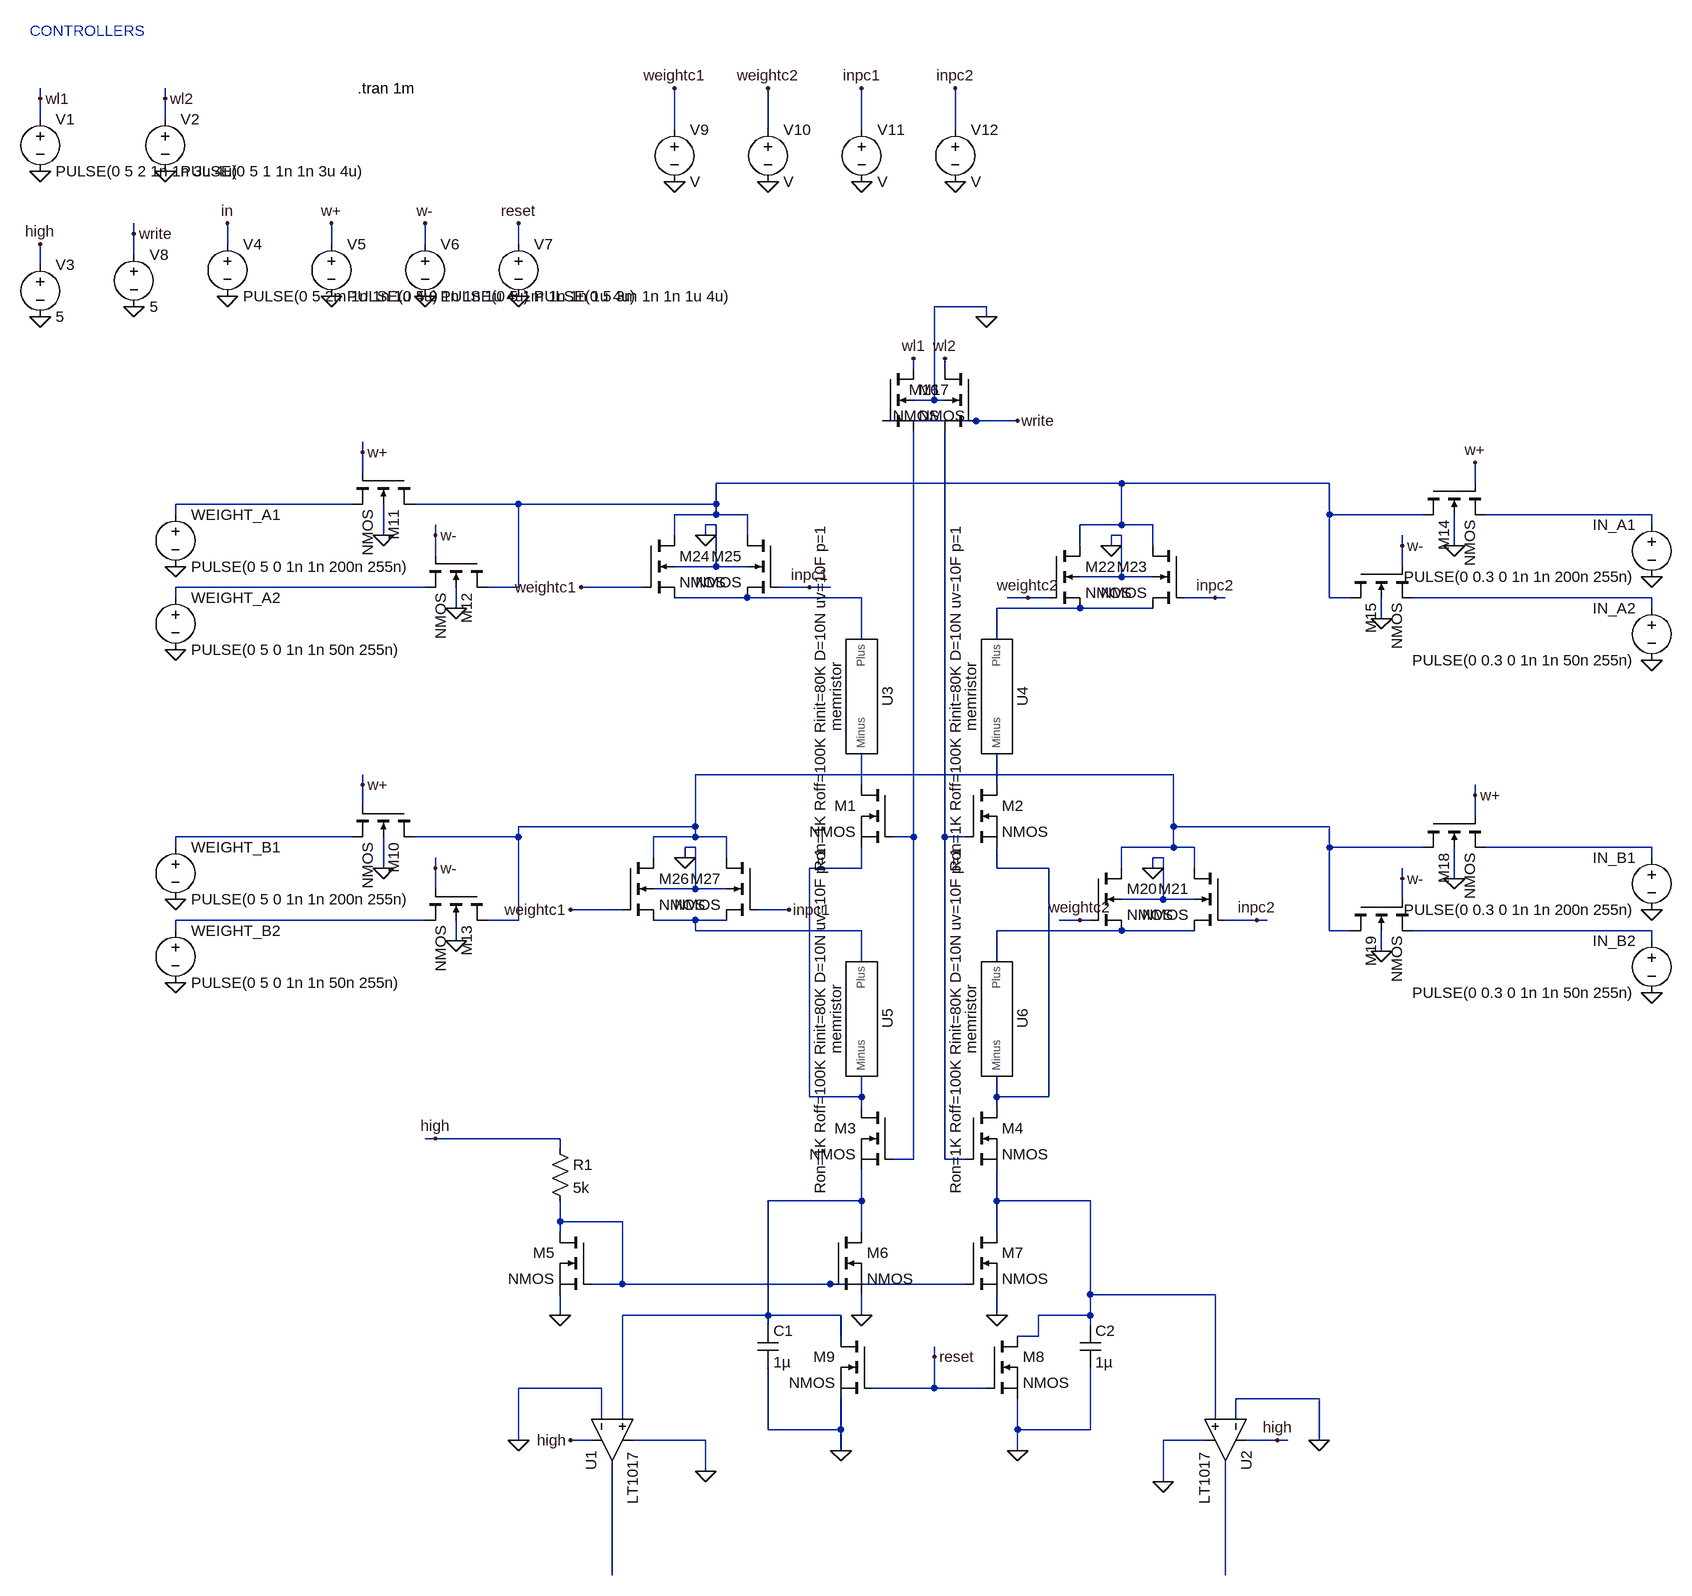
[diagram p0: schematic mac_v1.asc]
mac_v1.asc, the LTspice schematic file:
Version 4
SHEET 1 2132 1428
WIRE -864 -848 -864 -864
WIRE -672 -848 -672 -864
WIRE -864 -816 -864 -848
WIRE -672 -816 -672 -848
WIRE 112 -800 112 -864
WIRE 256 -800 256 -864
WIRE 400 -800 400 -864
WIRE 544 -800 544 -864
WIRE -720 -640 -720 -656
WIRE -576 -624 -576 -656
WIRE -416 -624 -416 -656
WIRE -272 -624 -272 -656
WIRE -128 -624 -128 -656
WIRE -720 -608 -720 -640
WIRE -864 -592 -864 -624
WIRE 592 -528 512 -528
WIRE 592 -512 592 -528
WIRE 480 -432 480 -448
WIRE 528 -432 528 -448
WIRE 512 -384 512 -528
WIRE 512 -384 480 -384
WIRE 528 -384 512 -384
WIRE 576 -352 432 -352
WIRE 640 -352 576 -352
WIRE -368 -304 -368 -320
WIRE -368 -272 -368 -304
WIRE 800 -256 176 -256
WIRE 1120 -256 800 -256
WIRE 1344 -256 1344 -288
WIRE -384 -224 -656 -224
WIRE -128 -224 -288 -224
WIRE 176 -224 176 -256
WIRE 176 -224 -128 -224
WIRE -656 -208 -656 -224
WIRE 176 -208 176 -224
WIRE 176 -208 112 -208
WIRE 224 -208 176 -208
WIRE 1120 -208 1120 -256
WIRE 1264 -208 1120 -208
WIRE 1616 -208 1360 -208
WIRE 176 -192 160 -192
WIRE 800 -192 800 -256
WIRE 800 -192 736 -192
WIRE 848 -192 800 -192
WIRE 1616 -192 1616 -208
WIRE -336 -176 -336 -224
WIRE -256 -176 -256 -192
WIRE 112 -176 112 -208
WIRE 160 -176 160 -192
WIRE 224 -176 224 -208
WIRE 800 -176 784 -176
WIRE 736 -160 736 -192
WIRE 784 -160 784 -176
WIRE 848 -160 848 -192
WIRE 1232 -160 1232 -176
WIRE 1312 -160 1312 -208
WIRE -256 -144 -256 -176
WIRE 176 -128 176 -192
WIRE 176 -128 112 -128
WIRE 224 -128 176 -128
WIRE 1232 -128 1232 -160
WIRE 800 -112 800 -176
WIRE 800 -112 736 -112
WIRE 848 -112 800 -112
WIRE -272 -96 -656 -96
WIRE -128 -96 -128 -224
WIRE -128 -96 -176 -96
WIRE 64 -96 -32 -96
WIRE 320 -96 272 -96
WIRE 352 -96 320 -96
WIRE -656 -80 -656 -96
WIRE 224 -80 112 -80
WIRE 400 -80 224 -80
WIRE 656 -80 624 -80
WIRE 688 -80 656 -80
WIRE 944 -80 896 -80
WIRE 960 -80 944 -80
WIRE 1120 -80 1120 -208
WIRE 1152 -80 1120 -80
WIRE 1616 -80 1248 -80
WIRE -224 -64 -224 -96
WIRE 736 -64 608 -64
WIRE 848 -64 736 -64
WIRE 1616 -64 1616 -80
WIRE 1200 -48 1200 -80
WIRE 400 -16 400 -80
WIRE 608 -16 608 -64
WIRE 880 192 144 192
WIRE -368 208 -368 192
WIRE 400 208 400 160
WIRE 608 208 608 160
WIRE 1344 224 1344 208
WIRE -368 240 -368 208
WIRE 1344 256 1344 224
WIRE 144 272 144 192
WIRE 144 272 -128 272
WIRE 880 272 880 192
WIRE 1120 272 880 272
WIRE -384 288 -656 288
WIRE -128 288 -128 272
WIRE -128 288 -288 288
WIRE 144 288 144 272
WIRE 144 288 80 288
WIRE 192 288 144 288
WIRE 480 288 480 -336
WIRE 480 288 448 288
WIRE 528 288 528 -336
WIRE 560 288 528 288
WIRE -656 304 -656 288
WIRE 144 304 128 304
WIRE 880 304 880 272
WIRE 880 304 800 304
WIRE 912 304 880 304
WIRE 1120 304 1120 272
WIRE 1264 304 1120 304
WIRE 1616 304 1360 304
WIRE 80 320 80 288
WIRE 128 320 128 304
WIRE 192 320 192 288
WIRE 864 320 848 320
WIRE 1616 320 1616 304
WIRE -336 336 -336 288
WIRE -256 336 -256 320
WIRE 400 336 400 304
WIRE 400 336 320 336
WIRE 608 336 608 304
WIRE 688 336 608 336
WIRE 800 336 800 304
WIRE 848 336 848 320
WIRE 912 336 912 304
WIRE 1232 352 1232 336
WIRE 1312 352 1312 304
WIRE -256 368 -256 336
WIRE 144 368 144 304
WIRE 144 368 80 368
WIRE 192 368 144 368
WIRE 864 384 864 320
WIRE 864 384 800 384
WIRE 912 384 864 384
WIRE 1232 384 1232 352
WIRE 32 400 -48 400
WIRE 288 400 240 400
WIRE -272 416 -656 416
WIRE -128 416 -128 288
WIRE -128 416 -176 416
WIRE 144 416 80 416
WIRE 192 416 144 416
WIRE 736 416 704 416
WIRE 752 416 736 416
WIRE 1008 416 960 416
WIRE 1024 416 1008 416
WIRE -656 432 -656 416
WIRE 144 432 144 416
WIRE 400 432 144 432
WIRE 800 432 608 432
WIRE 912 432 800 432
WIRE 1120 432 1120 304
WIRE 1152 432 1120 432
WIRE 1616 432 1248 432
WIRE -224 448 -224 416
WIRE 1616 448 1616 432
WIRE 1200 464 1200 432
WIRE 400 480 400 432
WIRE 608 480 608 432
WIRE 320 688 320 336
WIRE 400 688 400 656
WIRE 400 688 320 688
WIRE 608 688 608 656
WIRE 688 688 688 336
WIRE 688 688 608 688
WIRE 400 704 400 688
WIRE 608 704 608 688
WIRE -256 752 -272 752
WIRE -64 752 -256 752
WIRE -64 768 -64 752
WIRE 480 784 480 288
WIRE 480 784 448 784
WIRE 528 784 528 288
WIRE 560 784 528 784
WIRE 400 848 400 800
WIRE 400 848 256 848
WIRE 608 848 608 800
WIRE 752 848 608 848
WIRE -64 880 -64 848
WIRE 32 880 -64 880
WIRE -64 896 -64 880
WIRE 400 896 400 848
WIRE 608 896 608 848
WIRE 32 976 32 880
WIRE 32 976 -16 976
WIRE 352 976 32 976
WIRE 560 976 352 976
WIRE 752 992 752 848
WIRE 944 992 752 992
WIRE -64 1024 -64 992
WIRE 256 1024 256 848
WIRE 256 1024 32 1024
WIRE 368 1024 256 1024
WIRE 400 1024 400 992
WIRE 608 1024 608 992
WIRE 752 1024 752 992
WIRE 752 1024 672 1024
WIRE 256 1040 256 1024
WIRE 752 1040 752 1024
WIRE 368 1056 368 1024
WIRE 672 1056 672 1024
WIRE 672 1056 640 1056
WIRE 512 1088 512 1072
WIRE 0 1136 -128 1136
WIRE 512 1136 512 1088
WIRE 512 1136 416 1136
WIRE 592 1136 512 1136
WIRE 1104 1152 976 1152
WIRE 0 1184 0 1136
WIRE 32 1184 32 1024
WIRE 944 1184 944 992
WIRE 976 1184 976 1152
WIRE 256 1200 256 1104
WIRE 368 1200 368 1152
WIRE 368 1200 256 1200
WIRE 640 1200 640 1152
WIRE 752 1200 752 1104
WIRE 752 1200 640 1200
WIRE -128 1216 -128 1136
WIRE -16 1216 -48 1216
WIRE 160 1216 48 1216
WIRE 928 1216 864 1216
WIRE 1040 1216 992 1216
WIRE 1056 1216 1040 1216
WIRE 1104 1216 1104 1152
WIRE 368 1232 368 1200
WIRE 640 1232 640 1200
WIRE 160 1264 160 1216
WIRE 864 1280 864 1216
WIRE 16 1424 16 1248
WIRE 960 1424 960 1248
FLAG -864 -736 0
FLAG -864 -848 wl1
FLAG -672 -736 0
FLAG -672 -848 wl2
FLAG 400 1024 0
FLAG -64 1024 0
FLAG 608 1024 0
FLAG 640 1232 0
FLAG 368 1232 0
FLAG 160 1264 0
FLAG 864 1280 0
FLAG -864 -512 0
FLAG -864 -624 high
FLAG 1040 1216 high
FLAG -48 1216 high
FLAG -128 1216 0
FLAG 1104 1216 0
FLAG -256 752 high
FLAG -656 -128 0
FLAG -656 0 0
FLAG -576 -544 0
FLAG -416 -544 0
FLAG -272 -544 0
FLAG -576 -656 in
FLAG -272 -656 w-
FLAG -416 -656 w+
FLAG -368 -304 w+
FLAG -256 -176 w-
FLAG 512 1088 reset
FLAG -336 -176 0
FLAG -224 -64 0
FLAG -128 -544 0
FLAG -128 -656 reset
FLAG 480 -448 wl1
FLAG 528 -448 wl2
FLAG 592 -512 0
FLAG -720 -528 0
FLAG -720 -640 write
FLAG 640 -352 write
FLAG -656 384 0
FLAG -656 512 0
FLAG -368 208 w+
FLAG -256 336 w-
FLAG -336 336 0
FLAG -224 448 0
FLAG 1616 -112 0
FLAG 1616 16 0
FLAG 1344 -288 w+
FLAG 1232 -160 w-
FLAG 1312 -160 0
FLAG 1200 -48 0
FLAG 1616 400 0
FLAG 1616 528 0
FLAG 1344 224 w+
FLAG 1232 352 w-
FLAG 1312 352 0
FLAG 1200 464 0
FLAG 848 336 0
FLAG 784 -160 0
FLAG 160 -176 0
FLAG 128 320 0
FLAG 656 -80 weightc2
FLAG 944 -80 inpc2
FLAG 1008 416 inpc2
FLAG 736 416 weightc2
FLAG 320 -96 inpc1
FLAG -32 -96 weightc1
FLAG 288 400 inpc1
FLAG -48 400 weightc1
FLAG 112 -720 0
FLAG 256 -720 0
FLAG 400 -720 0
FLAG 544 -720 0
FLAG 112 -864 weightc1
FLAG 256 -864 weightc2
FLAG 400 -864 inpc1
FLAG 544 -864 inpc2
SYMBOL nmos 448 208 M0
SYMATTR InstName M1
SYMBOL nmos 560 208 R0
SYMATTR InstName M2
SYMBOL nmos 448 704 M0
SYMATTR InstName M3
SYMBOL nmos 560 704 R0
SYMATTR InstName M4
SYMBOL Voltage -864 -832 R0
SYMATTR InstName V1
SYMATTR Value PULSE(0 5 2 1n 1n 3u 4u)
SYMBOL Voltage -672 -832 R0
SYMATTR InstName V2
SYMATTR Value PULSE(0 5 1 1n 1n 3u 4u)
SYMBOL nmos -16 896 M0
SYMATTR InstName M5
SYMBOL nmos 352 896 R0
SYMATTR InstName M6
SYMBOL nmos 560 896 R0
SYMATTR InstName M7
SYMBOL Res -80 752 R0
SYMATTR InstName R1
SYMATTR Value 5k
SYMBOL Cap 240 1040 R0
SYMATTR InstName C1
SYMATTR Value 1µ
SYMBOL Cap 736 1040 R0
SYMATTR InstName C2
SYMATTR Value 1µ
SYMBOL nmos 592 1056 R0
SYMATTR InstName M8
SYMBOL nmos 416 1056 M0
SYMATTR InstName M9
SYMBOL LT1017 16 1216 M90
SYMATTR InstName U1
SYMBOL LT1017 960 1216 R90
SYMATTR InstName U2
SYMBOL Voltage -864 -608 R0
SYMATTR InstName V3
SYMATTR Value 5
SYMBOL Voltage -656 -224 R0
SYMATTR InstName WEIGHT_A1
SYMATTR Value PULSE(0 5 0 1n 1n 200n 255n)
SYMBOL Voltage -656 -96 R0
SYMATTR InstName WEIGHT_A2
SYMATTR Value PULSE(0 5 0 1n 1n 50n 255n)
SYMBOL Voltage -576 -640 R0
SYMATTR InstName V4
SYMATTR Value PULSE(0 5 2m 1n 1n 1u 4u)
SYMBOL Voltage -416 -640 R0
SYMATTR InstName V5
SYMATTR Value PULSE(0 5 0 1n 1n 1u 4u)
SYMBOL Voltage -272 -640 R0
SYMATTR InstName V6
SYMATTR Value PULSE(0 5 1m 1n 1n 1u 4u)
SYMBOL nmos4 -288 -272 R90
SYMATTR InstName M11
SYMBOL nmos4 -176 -144 R90
SYMATTR InstName M12
SYMBOL Voltage -128 -640 R0
SYMATTR InstName V7
SYMATTR Value PULSE(0 5 3m 1n 1n 1u 4u)
SYMBOL nmos4 576 -432 M0
SYMATTR InstName M16
SYMBOL nmos4 432 -432 R0
SYMATTR InstName M17
SYMBOL Voltage -720 -624 R0
SYMATTR InstName V8
SYMATTR Value 5
SYMBOL memristor 400 64 R90
SYMATTR InstName U3
SYMBOL memristor 608 64 R90
SYMATTR InstName U4
SYMBOL memristor 400 560 R90
SYMATTR InstName U5
SYMBOL memristor 608 560 R90
SYMATTR InstName U6
SYMBOL Voltage -656 288 R0
SYMATTR InstName WEIGHT_B1
SYMATTR Value PULSE(0 5 0 1n 1n 200n 255n)
SYMBOL Voltage -656 416 R0
SYMATTR InstName WEIGHT_B2
SYMATTR Value PULSE(0 5 0 1n 1n 50n 255n)
SYMBOL nmos4 -288 240 R90
SYMATTR InstName M10
SYMBOL nmos4 -176 368 R90
SYMATTR InstName M13
SYMBOL Voltage 1616 -208 M0
SYMATTR InstName IN_A1
SYMATTR Value PULSE(0 0.3 0 1n 1n 200n 255n)
SYMBOL Voltage 1616 -80 M0
SYMATTR InstName IN_A2
SYMATTR Value PULSE(0 0.3 0 1n 1n 50n 255n)
SYMBOL nmos4 1264 -256 M90
SYMATTR InstName M14
SYMBOL nmos4 1152 -128 M90
SYMATTR InstName M15
SYMBOL Voltage 1616 304 M0
SYMATTR InstName IN_B1
SYMATTR Value PULSE(0 0.3 0 1n 1n 200n 255n)
SYMBOL Voltage 1616 432 M0
SYMATTR InstName IN_B2
SYMATTR Value PULSE(0 0.3 0 1n 1n 50n 255n)
SYMBOL nmos4 1264 256 M90
SYMATTR InstName M18
SYMBOL nmos4 1152 384 M90
SYMATTR InstName M19
SYMBOL nmos4 752 336 R0
SYMATTR InstName M20
SYMBOL nmos4 960 336 M0
SYMATTR InstName M21
SYMBOL nmos4 688 -160 R0
SYMATTR InstName M22
SYMBOL nmos4 896 -160 M0
SYMATTR InstName M23
SYMBOL nmos4 64 -176 R0
SYMATTR InstName M24
SYMBOL nmos4 272 -176 M0
SYMATTR InstName M25
SYMBOL nmos4 32 320 R0
SYMATTR InstName M26
SYMBOL nmos4 240 320 M0
SYMATTR InstName M27
SYMBOL Voltage 112 -816 R0
SYMATTR InstName V9
SYMBOL Voltage 256 -816 R0
SYMATTR InstName V10
SYMBOL Voltage 400 -816 R0
SYMATTR InstName V11
SYMBOL Voltage 544 -816 R0
SYMATTR InstName V12
TEXT -376 -864 Left 2 !.tran 1m
TEXT -880 -952 Left 2 ;CONTROLLERS

The netlist it stands for:
* mac_v1.asc
M1 N009 N012 N015 N015 NMOS
M2 N010 N013 N016 N016 NMOS
M3 N015 N012 N021 N021 NMOS
M4 N016 N013 N022 N022 NMOS
V1 wl1 0 PULSE(0 5 2 1n 1n 3u 4u)
V2 wl2 0 PULSE(0 5 1 1n 1n 3u 4u)
M5 N023 N023 0 0 NMOS
M6 N021 N023 0 0 NMOS
M7 N022 N023 0 0 NMOS
R1 high N023 5k
C1 N021 0 1µ
C2 N022 0 1µ
M8 N022 reset 0 0 NMOS
M9 N021 reset 0 0 NMOS
XU1 N021 0 high 0 N024 LT1017  ; pins In+ In- V+ V- OUT
XU2 N022 0 high 0 N025 LT1017  ; pins In+ In- V+ V- OUT
V3 high 0 5
V§WEIGHT_A1 N002 0 PULSE(0 5 0 1n 1n 200n 255n)
V§WEIGHT_A2 N004 0 PULSE(0 5 0 1n 1n 50n 255n)
V4 in 0 PULSE(0 5 2m 1n 1n 1u 4u)
V5 w+ 0 PULSE(0 5 0 1n 1n 1u 4u)
V6 w- 0 PULSE(0 5 1m 1n 1n 1u 4u)
M11 N001 w+ N002 0 NMOS
M12 N001 w- N004 0 NMOS
V7 reset 0 PULSE(0 5 3m 1n 1n 1u 4u)
M16 wl2 write N013 0 NMOS
M17 wl1 write N012 0 NMOS
V8 write 0 5
XU3 N005 N009 memristor Ron=1K Roff=100K Rinit=80K D=10N uv=10F p=1  ; pins Plus Minus
XU4 N007 N010 memristor Ron=1K Roff=100K Rinit=80K D=10N uv=10F p=1  ; pins Plus Minus
XU5 N018 N015 memristor Ron=1K Roff=100K Rinit=80K D=10N uv=10F p=1  ; pins Plus Minus
XU6 N019 N016 memristor Ron=1K Roff=100K Rinit=80K D=10N uv=10F p=1  ; pins Plus Minus
V§WEIGHT_B1 N011 0 PULSE(0 5 0 1n 1n 200n 255n)
V§WEIGHT_B2 N017 0 PULSE(0 5 0 1n 1n 50n 255n)
M10 N008 w+ N011 0 NMOS
M13 N008 w- N017 0 NMOS
V§IN_A1 N003 0 PULSE(0 0.3 0 1n 1n 200n 255n)
V§IN_A2 N006 0 PULSE(0 0.3 0 1n 1n 50n 255n)
M14 N001 w+ N003 0 NMOS
M15 N001 w- N006 0 NMOS
V§IN_B1 N014 0 PULSE(0 0.3 0 1n 1n 200n 255n)
V§IN_B2 N020 0 PULSE(0 0.3 0 1n 1n 50n 255n)
M18 N008 w+ N014 0 NMOS
M19 N008 w- N020 0 NMOS
M20 N008 weightc2 N019 0 NMOS
M21 N008 inpc2 N019 0 NMOS
M22 N001 weightc2 N007 0 NMOS
M23 N001 inpc2 N007 0 NMOS
M24 N001 weightc1 N005 0 NMOS
M25 N001 inpc1 N005 0 NMOS
M26 N008 weightc1 N018 0 NMOS
M27 N008 inpc1 N018 0 NMOS
V9 weightc1 0 V
V10 weightc2 0 V
V11 inpc1 0 V
V12 inpc2 0 V
.model NMOS NMOS
.model PMOS PMOS
.lib standard.mos
.tran 1m
* CONTROLLERS
.lib D:\Chip Design Studio IIITB\Memristor\memristor.lib.cir
.backanno
.end